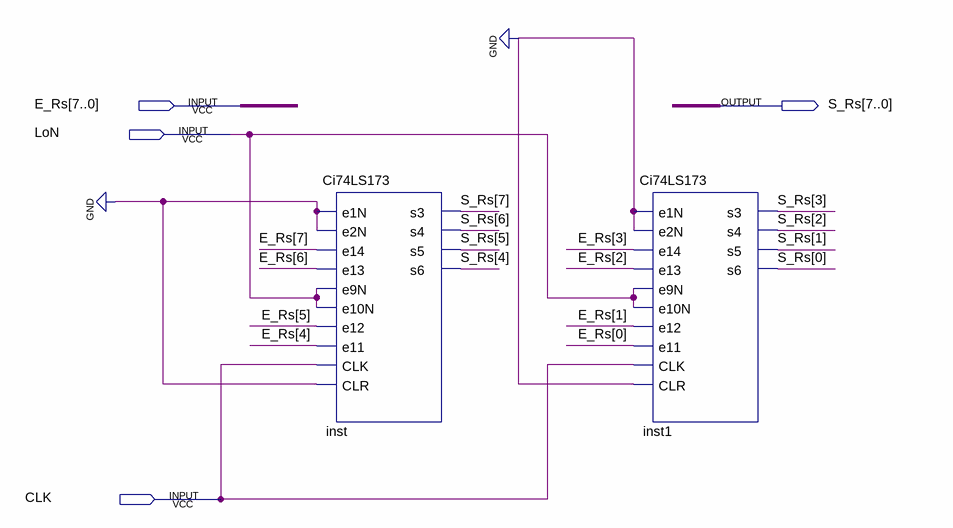
[diagram p0: schematic sheet]
// Quartus schematic Registrador_Saida.bdf as structural Verilog: 2 symbols, 4 pins
module Registrador_Saida (
  input  [7:0] E_Rs,
  input  LoN,
  input  CLK,
  output [7:0] S_Rs
);

  Ci74LS173 inst (
    .e1N(1'b0), .e2N(1'b0), .e14(E_Rs[7]), .e13(E_Rs[6]), .e9N(LoN), .e10N(LoN), .e12(E_Rs[5]),
    .e11(E_Rs[4]), .CLK(CLK), .CLR(1'b0), .s3(S_Rs[7]), .s4(S_Rs[6]), .s5(S_Rs[5]), .s6(S_Rs[4]));
  Ci74LS173 inst1 (
    .e1N(1'b0), .e2N(1'b0), .e14(E_Rs[3]), .e13(E_Rs[2]), .e9N(LoN), .e10N(LoN), .e12(E_Rs[1]),
    .e11(E_Rs[0]), .CLK(CLK), .CLR(1'b0), .s3(S_Rs[3]), .s4(S_Rs[2]), .s5(S_Rs[1]), .s6(S_Rs[0]));
endmodule
